# EAGLE design FY - OPTO_BOARD_3_GEN (EAGLE 6.1)

## Sheet 1 of 2
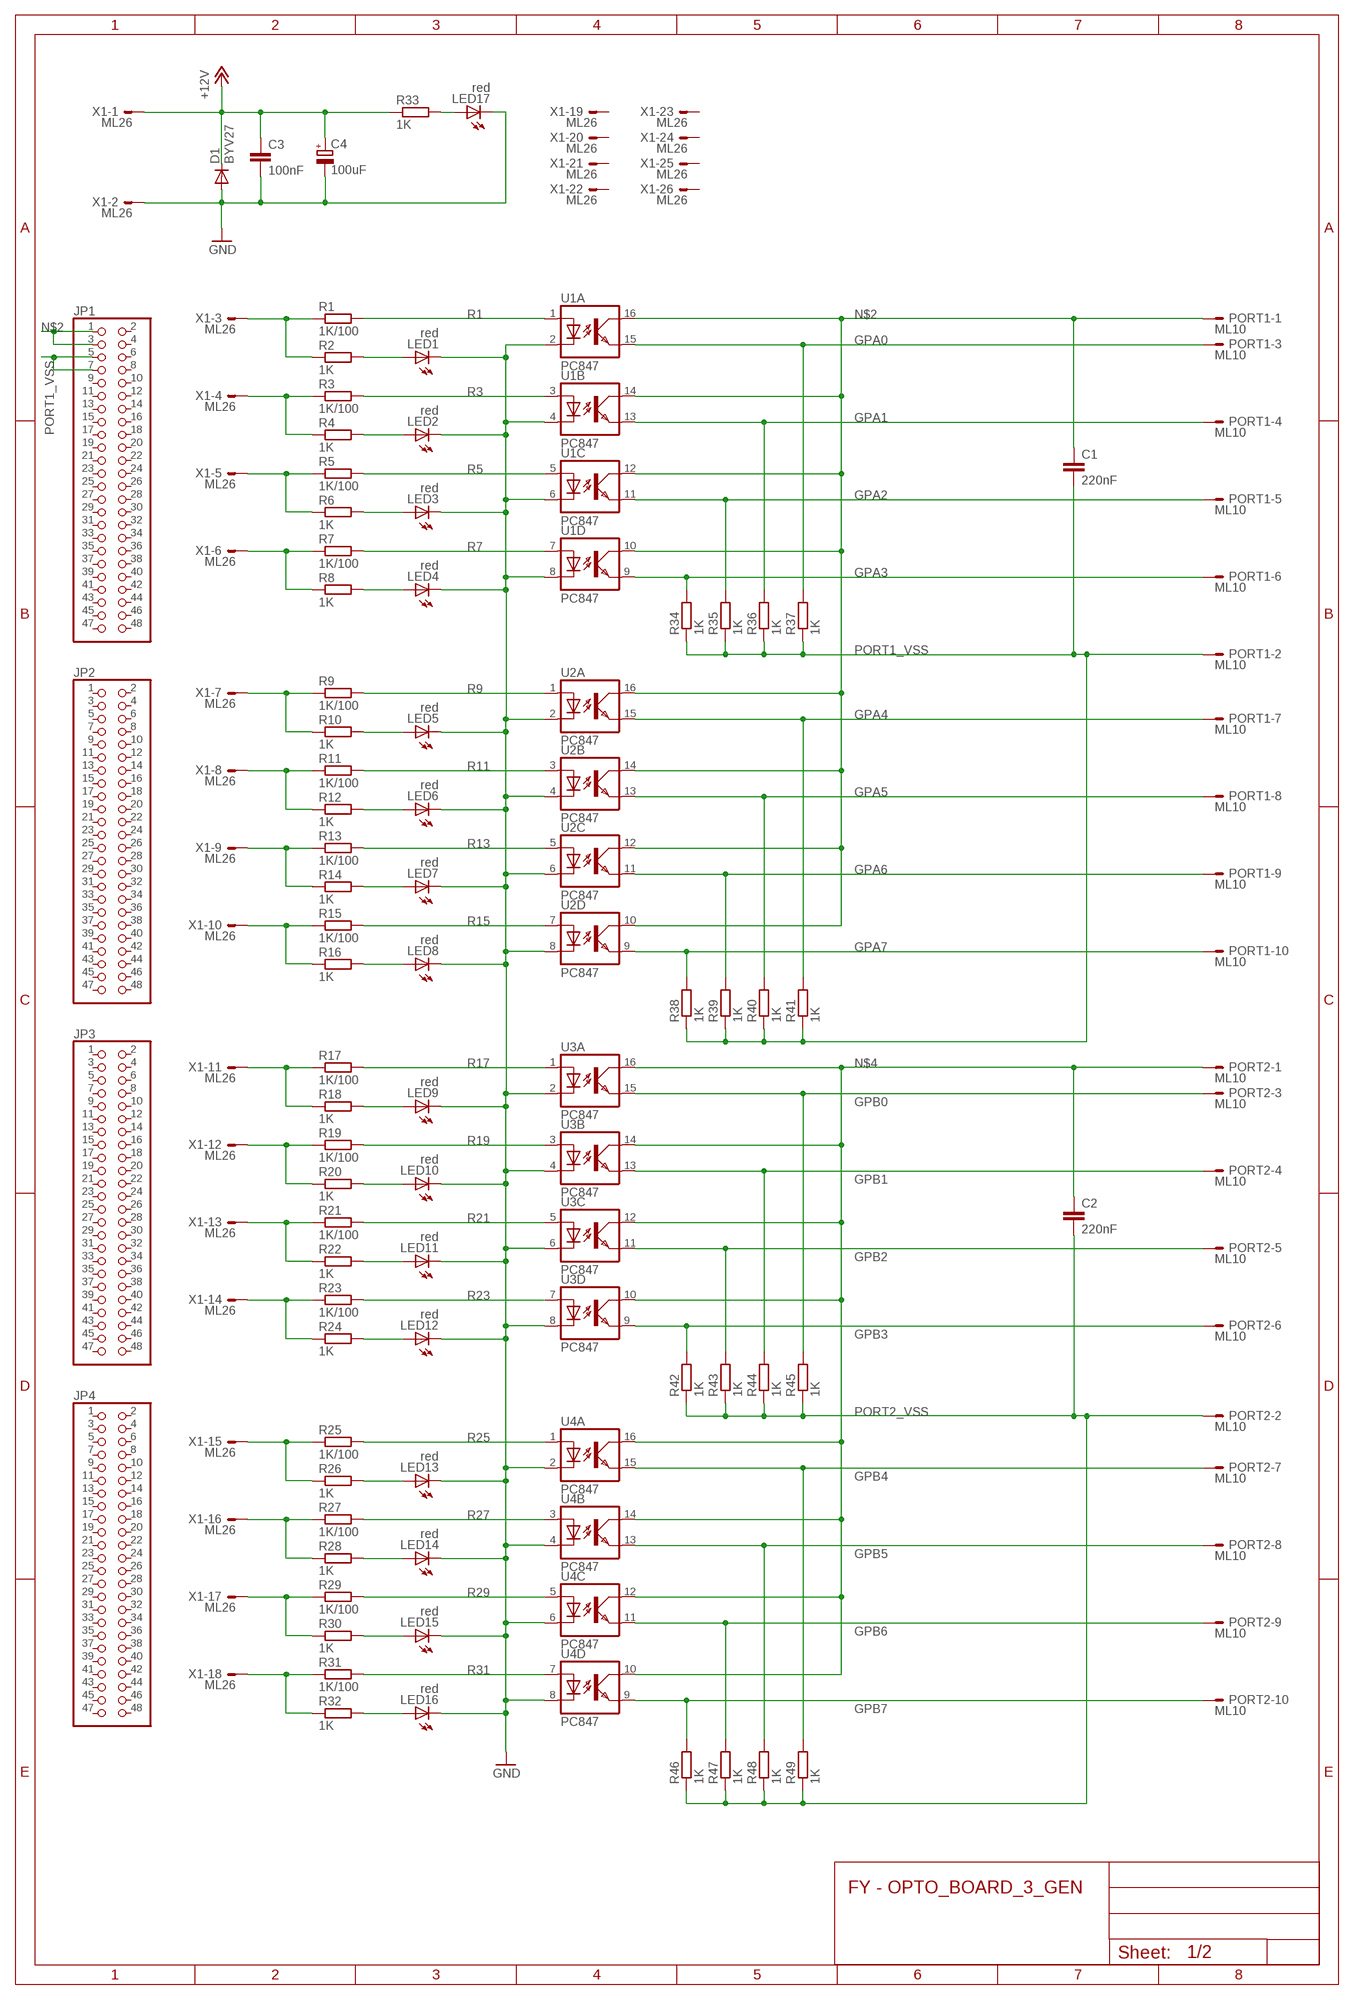
[diagram p0: schematic, sheet 1]

### Parts
C1  220nF  C-EU050-025X075  [C050-025X075]
C2  220nF  C-EU050-025X075  [C050-025X075]
C3  100nF  C-EU050-025X075  [C050-025X075]
C4  100uF  CPOL-EUE5-8.5  [E5-8,5]
D1  BYV27  [SOD57-10]
JP1  PINHD-2X24  [2X24]
JP2  PINHD-2X24  [2X24]
JP3  PINHD-2X24  [2X24]
JP4  PINHD-2X24  [2X24]
LED1  red  LED3MM  [LED3MM]
LED2  red  LED3MM  [LED3MM]
LED3  red  LED3MM  [LED3MM]
LED4  red  LED3MM  [LED3MM]
LED5  red  LED3MM  [LED3MM]
LED6  red  LED3MM  [LED3MM]
LED7  red  LED3MM  [LED3MM]
LED8  red  LED3MM  [LED3MM]
LED9  red  LED3MM  [LED3MM]
LED10  red  LED3MM  [LED3MM]
LED11  red  LED3MM  [LED3MM]
LED12  red  LED3MM  [LED3MM]
LED13  red  LED3MM  [LED3MM]
LED14  red  LED3MM  [LED3MM]
LED15  red  LED3MM  [LED3MM]
LED16  red  LED3MM  [LED3MM]
LED17  red  LED3MM  [LED3MM]
PORT1  ML10  ML10E  [ML10]
PORT2  ML10  ML10E  [ML10]
R1  1K/100  R-EU_0207/10  [0207/10]
R2  1K  R-EU_0207/10  [0207/10]
R3  1K/100  R-EU_0207/10  [0207/10]
R4  1K  R-EU_0207/10  [0207/10]
R5  1K/100  R-EU_0207/10  [0207/10]
R6  1K  R-EU_0207/10  [0207/10]
R7  1K/100  R-EU_0207/10  [0207/10]
R8  1K  R-EU_0207/10  [0207/10]
R9  1K/100  R-EU_0207/10  [0207/10]
R10  1K  R-EU_0207/10  [0207/10]
R11  1K/100  R-EU_0207/10  [0207/10]
R12  1K  R-EU_0207/10  [0207/10]
R13  1K/100  R-EU_0207/10  [0207/10]
R14  1K  R-EU_0207/10  [0207/10]
R15  1K/100  R-EU_0207/10  [0207/10]
R16  1K  R-EU_0207/10  [0207/10]
R17  1K/100  R-EU_0207/10  [0207/10]
R18  1K  R-EU_0207/10  [0207/10]
R19  1K/100  R-EU_0207/10  [0207/10]
R20  1K  R-EU_0207/10  [0207/10]
R21  1K/100  R-EU_0207/10  [0207/10]
R22  1K  R-EU_0207/10  [0207/10]
R23  1K/100  R-EU_0207/10  [0207/10]
R24  1K  R-EU_0207/10  [0207/10]
R25  1K/100  R-EU_0207/10  [0207/10]
R26  1K  R-EU_0207/10  [0207/10]
R27  1K/100  R-EU_0207/10  [0207/10]
R28  1K  R-EU_0207/10  [0207/10]
R29  1K/100  R-EU_0207/10  [0207/10]
R30  1K  R-EU_0207/10  [0207/10]
R31  1K/100  R-EU_0207/10  [0207/10]
R32  1K  R-EU_0207/10  [0207/10]
R33  1K  R-EU_0207/10  [0207/10]
R34  1K  R-EU_0207/10  [0207/10]
R35  1K  R-EU_0207/10  [0207/10]
R36  1K  R-EU_0207/10  [0207/10]
R37  1K  R-EU_0207/10  [0207/10]
R38  1K  R-EU_0207/10  [0207/10]
R39  1K  R-EU_0207/10  [0207/10]
R40  1K  R-EU_0207/10  [0207/10]
R41  1K  R-EU_0207/10  [0207/10]
R42  1K  R-EU_0207/10  [0207/10]
R43  1K  R-EU_0207/10  [0207/10]
R44  1K  R-EU_0207/10  [0207/10]
R45  1K  R-EU_0207/10  [0207/10]
R46  1K  R-EU_0207/10  [0207/10]
R47  1K  R-EU_0207/10  [0207/10]
R48  1K  R-EU_0207/10  [0207/10]
R49  1K  R-EU_0207/10  [0207/10]
U1  PC847  [DIL16]
U2  PC847  [DIL16]
U3  PC847  [DIL16]
U4  PC847  [DIL16]
X1  ML26  ML26E  [ML26]

### Nets
+12V [Power]: C3.1 C4.+ D1.C R33.1 X1.1 ; also sheet 2
GND [Power]: C3.2 C4.- D1.A LED1.K(C) LED2.K(C) LED3.K(C) LED4.K(C) LED5.K(C) LED6.K(C) LED7.K(C) LED8.K(C) LED9.K(C) LED10.K(C) LED11.K(C) LED12.K(C) LED13.K(C) LED14.K(C) LED15.K(C) LED16.K(C) LED17.K(C) U1.2(A:C) U1.4(B:C) U1.6(C:C) U1.8(D:C) U2.2(A:C) U2.4(B:C) U2.6(C:C) U2.8(D:C) U3.2(A:C) U3.4(B:C) U3.6(C:C) U3.8(D:C) U4.2(A:C) U4.4(B:C) U4.6(C:C) U4.8(D:C) X1.2
GPA0: PORT1.3 R37.2 U1.15(A:EMIT) ; also sheet 2
GPA1: PORT1.4 R36.2 U1.13(B:EMIT) ; also sheet 2
GPA2: PORT1.5 R35.2 U1.11(C:EMIT) ; also sheet 2
GPA3: PORT1.6 R34.2 U1.9(D:EMIT) ; also sheet 2
GPA4: PORT1.7 R41.2 U2.15(A:EMIT) ; also sheet 2
GPA5: PORT1.8 R40.2 U2.13(B:EMIT) ; also sheet 2
GPA6: PORT1.9 R39.2 U2.11(C:EMIT) ; also sheet 2
GPA7: PORT1.10 R38.2 U2.9(D:EMIT) ; also sheet 2
GPB0: PORT2.3 R45.2 U3.15(A:EMIT) ; also sheet 2
GPB1: PORT2.4 R44.2 U3.13(B:EMIT) ; also sheet 2
GPB2: PORT2.5 R43.2 U3.11(C:EMIT) ; also sheet 2
GPB3: PORT2.6 R42.2 U3.9(D:EMIT) ; also sheet 2
GPB4: PORT2.7 R49.2 U4.15(A:EMIT) ; also sheet 2
GPB5: PORT2.8 R48.2 U4.13(B:EMIT) ; also sheet 2
GPB6: PORT2.9 R47.2 U4.11(C:EMIT) ; also sheet 2
GPB7: PORT2.10 R46.2 U4.9(D:EMIT) ; also sheet 2
N$2 [Power]: C1.1 JP1.1 JP1.3 PORT1.1 U1.10(D:COL) U1.12(C:COL) U1.14(B:COL) U1.16(A:COL) U2.10(D:COL) U2.12(C:COL) U2.14(B:COL) U2.16(A:COL)
N$3: LED1.A R2.2
N$4 [Power]: C2.1 PORT2.1 U3.10(D:COL) U3.12(C:COL) U3.14(B:COL) U3.16(A:COL) U4.10(D:COL) U4.12(C:COL) U4.14(B:COL) U4.16(A:COL) ; also sheet 2
N$5: LED2.A R4.2
N$6: LED3.A R6.2
N$7: LED4.A R8.2
N$16: LED5.A R10.2
N$20: LED6.A R12.2
N$23: LED7.A R14.2
N$26: LED8.A R16.2
N$30: LED9.A R18.2
N$33: LED10.A R20.2
N$36: LED11.A R22.2
N$39: LED12.A R24.2
N$41: LED13.A R26.2
N$44: LED14.A R28.2
N$47: LED15.A R30.2
N$50: LED16.A R32.2
N$52: LED17.A R33.2
PORT1_VSS [Power]: C1.2 JP1.5 JP1.7 PORT1.2 R34.1 R35.1 R36.1 R37.1 R38.1 R39.1 R40.1 R41.1 ; also sheet 2
PORT2_VSS [Power]: C2.2 PORT2.2 R42.1 R43.1 R44.1 R45.1 R46.1 R47.1 R48.1 R49.1 ; also sheet 2
R1: R1.2 U1.1(A:A) ; also sheet 2
R3: R3.2 U1.3(B:A) ; also sheet 2
R5: R5.2 U1.5(C:A) ; also sheet 2
R7: R7.2 U1.7(D:A) ; also sheet 2
R9: R9.2 U2.1(A:A) ; also sheet 2
R11: R11.2 U2.3(B:A) ; also sheet 2
R13: R13.2 U2.5(C:A) ; also sheet 2
R15: R15.2 U2.7(D:A) ; also sheet 2
R17: R17.2 U3.1(A:A) ; also sheet 2
R19: R19.2 U3.3(B:A) ; also sheet 2
R21: R21.2 U3.5(C:A) ; also sheet 2
R23: R23.2 U3.7(D:A) ; also sheet 2
R25: R25.2 U4.1(A:A) ; also sheet 2
R27: R27.2 U4.3(B:A) ; also sheet 2
R29: R29.2 U4.5(C:A) ; also sheet 2
R31: R31.2 U4.7(D:A) ; also sheet 2
X1-3: R1.1 R2.1 X1.3
X1-4: R3.1 R4.1 X1.4
X1-5: R5.1 R6.1 X1.5
X1-6: R7.1 R8.1 X1.6
X1-7: R9.1 R10.1 X1.7
X1-8: R11.1 R12.1 X1.8
X1-9: R13.1 R14.1 X1.9
X1-10: R15.1 R16.1 X1.10
X1-11: R17.1 R18.1 X1.11
X1-12: R19.1 R20.1 X1.12
X1-13: R21.1 R22.1 X1.13
X1-14: R23.1 R24.1 X1.14
X1-15: R25.1 R26.1 X1.15
X1-16: R27.1 R28.1 X1.16
X1-17: R29.1 R30.1 X1.17
X1-18: R31.1 R32.1 X1.18
Unconnected: JP1.2 JP1.4 JP1.6 JP1.8 JP1.9 JP1.10 JP1.11 JP1.12 JP1.13 JP1.14 JP1.15 JP1.16 JP1.17 JP1.18 JP1.19 JP1.20 JP1.21 JP1.22 JP1.23 JP1.24 JP1.25 JP1.26 JP1.27 JP1.28 JP1.29 JP1.30 JP1.31 JP1.32 JP1.33 JP1.34 JP1.35 JP1.36 JP1.37 JP1.38 JP1.39 JP1.40 JP1.41 JP1.42 JP1.43 JP1.44 JP1.45 JP1.46 JP1.47 JP1.48 JP2.1 JP2.2 JP2.3 JP2.4 JP2.5 JP2.6 JP2.7 JP2.8 JP2.9 JP2.10 JP2.11 JP2.12 JP2.13 JP2.14 JP2.15 JP2.16 JP2.17 JP2.18 JP2.19 JP2.20 JP2.21 JP2.22 JP2.23 JP2.24 JP2.25 JP2.26 JP2.27 JP2.28 JP2.29 JP2.30 JP2.31 JP2.32 JP2.33 JP2.34 JP2.35 JP2.36 JP2.37 JP2.38 JP2.39 JP2.40 JP2.41 JP2.42 JP2.43 JP2.44 JP2.45 JP2.46 JP2.47 JP2.48 JP3.1 JP3.2 JP3.3 JP3.4 JP3.5 JP3.6 JP3.7 JP3.8 JP3.9 JP3.10 JP3.11 JP3.12 JP3.13 JP3.14 JP3.15 JP3.16 JP3.17 JP3.18 JP3.19 JP3.20 JP3.21 JP3.22 JP3.23 JP3.24 JP3.25 JP3.26 JP3.27 JP3.28 JP3.29 JP3.30 JP3.31 JP3.32 JP3.33 JP3.34 JP3.35 JP3.36 JP3.37 JP3.38 JP3.39 JP3.40 JP3.41 JP3.42 JP3.43 JP3.44 JP3.45 JP3.46 JP3.47 JP3.48 JP4.1 JP4.2 JP4.3 JP4.4 JP4.5 JP4.6 JP4.7 JP4.8 JP4.9 JP4.10 JP4.11 JP4.12 JP4.13 JP4.14 JP4.15 JP4.16 JP4.17 JP4.18 JP4.19 JP4.20 JP4.21 JP4.22 JP4.23 JP4.24 JP4.25 JP4.26 JP4.27 JP4.28 JP4.29 JP4.30 JP4.31 JP4.32 JP4.33 JP4.34 JP4.35 JP4.36 JP4.37 JP4.38 JP4.39 JP4.40 JP4.41 JP4.42 JP4.43 JP4.44 JP4.45 JP4.46 JP4.47 JP4.48 X1.19 X1.20 X1.21 X1.22 X1.23 X1.24 X1.25 X1.26

## Sheet 2 of 2
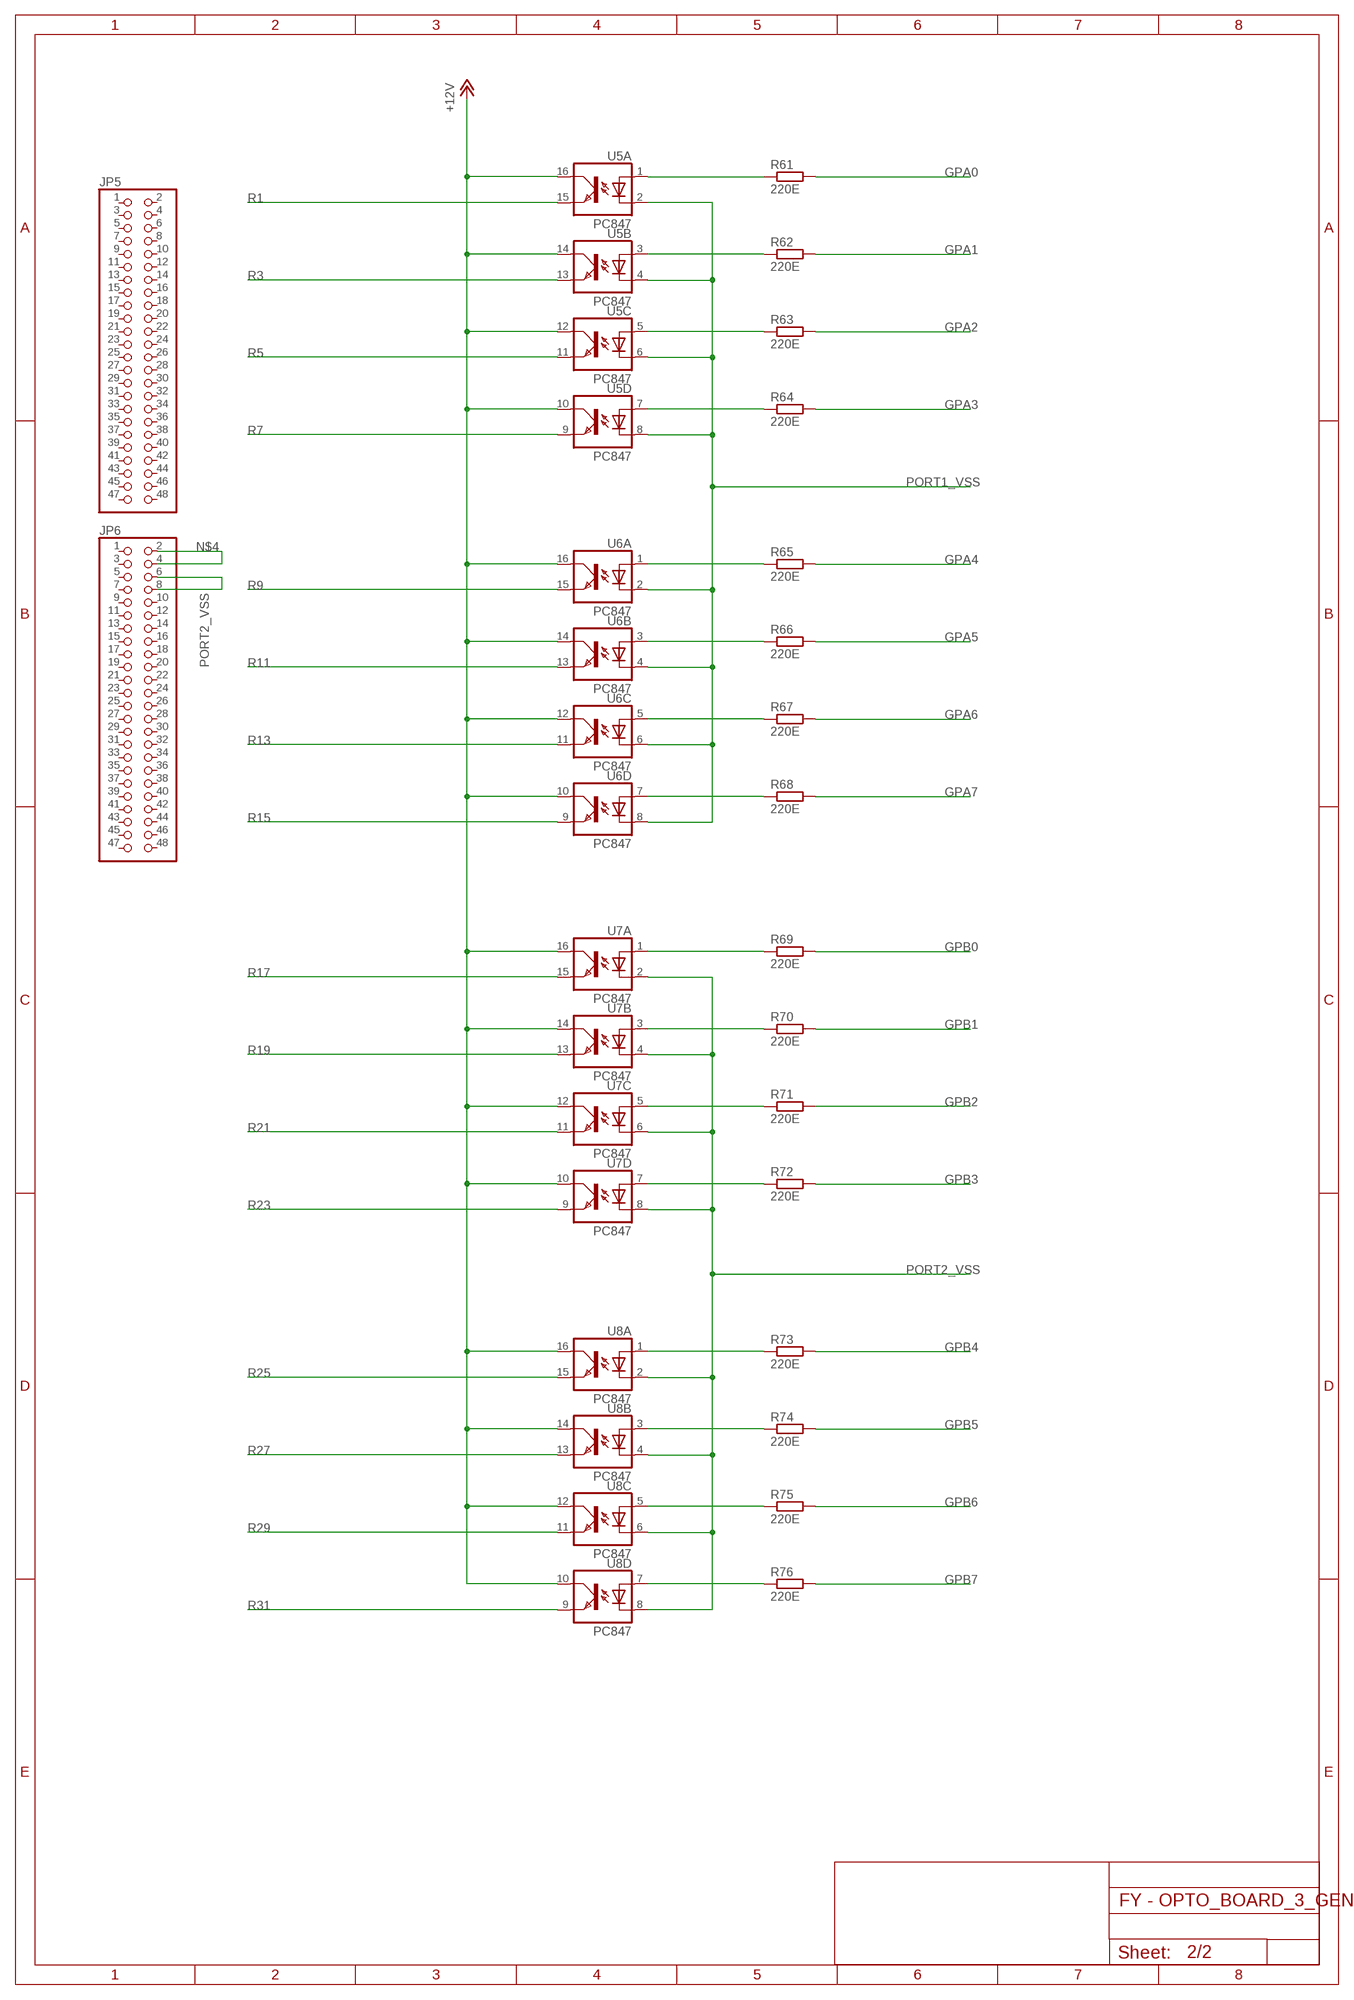
[diagram p1: schematic, sheet 2]

### Parts
JP5  PINHD-2X24  [2X24]
JP6  PINHD-2X24  [2X24]
R61  220E  R-EU_0207/10  [0207/10]
R62  220E  R-EU_0207/10  [0207/10]
R63  220E  R-EU_0207/10  [0207/10]
R64  220E  R-EU_0207/10  [0207/10]
R65  220E  R-EU_0207/10  [0207/10]
R66  220E  R-EU_0207/10  [0207/10]
R67  220E  R-EU_0207/10  [0207/10]
R68  220E  R-EU_0207/10  [0207/10]
R69  220E  R-EU_0207/10  [0207/10]
R70  220E  R-EU_0207/10  [0207/10]
R71  220E  R-EU_0207/10  [0207/10]
R72  220E  R-EU_0207/10  [0207/10]
R73  220E  R-EU_0207/10  [0207/10]
R74  220E  R-EU_0207/10  [0207/10]
R75  220E  R-EU_0207/10  [0207/10]
R76  220E  R-EU_0207/10  [0207/10]
U5  PC847  [DIL16]
U6  PC847  [DIL16]
U7  PC847  [DIL16]
U8  PC847  [DIL16]

### Nets
+12V [Power]: U5.10(D:COL) U5.12(C:COL) U5.14(B:COL) U5.16(A:COL) U6.10(D:COL) U6.12(C:COL) U6.14(B:COL) U6.16(A:COL) U7.10(D:COL) U7.12(C:COL) U7.14(B:COL) U7.16(A:COL) U8.10(D:COL) U8.12(C:COL) U8.14(B:COL) U8.16(A:COL) ; also sheet 1
GPA0: R61.2 ; also sheet 1
GPA1: R62.2 ; also sheet 1
GPA2: R63.2 ; also sheet 1
GPA3: R64.2 ; also sheet 1
GPA4: R65.2 ; also sheet 1
GPA5: R66.2 ; also sheet 1
GPA6: R67.2 ; also sheet 1
GPA7: R68.2 ; also sheet 1
GPB0: R69.2 ; also sheet 1
GPB1: R70.2 ; also sheet 1
GPB2: R71.2 ; also sheet 1
GPB3: R72.2 ; also sheet 1
GPB4: R73.2 ; also sheet 1
GPB5: R74.2 ; also sheet 1
GPB6: R75.2 ; also sheet 1
GPB7: R76.2 ; also sheet 1
N$1: R61.1 U5.1(A:A)
N$4 [Power]: JP6.2 JP6.4 ; also sheet 1
N$11: R62.1 U5.3(B:A)
N$12: R63.1 U5.5(C:A)
N$13: R64.1 U5.7(D:A)
N$14: R65.1 U6.1(A:A)
N$15: R66.1 U6.3(B:A)
N$17: R67.1 U6.5(C:A)
N$18: R68.1 U6.7(D:A)
N$19: R69.1 U7.1(A:A)
N$22: R70.1 U7.3(B:A)
N$25: R71.1 U7.5(C:A)
N$29: R72.1 U7.7(D:A)
N$31: R73.1 U8.1(A:A)
N$32: R74.1 U8.3(B:A)
N$35: R75.1 U8.5(C:A)
N$38: R76.1 U8.7(D:A)
PORT1_VSS [Power]: U5.2(A:C) U5.4(B:C) U5.6(C:C) U5.8(D:C) U6.2(A:C) U6.4(B:C) U6.6(C:C) U6.8(D:C) ; also sheet 1
PORT2_VSS [Power]: JP6.6 JP6.8 U7.2(A:C) U7.4(B:C) U7.6(C:C) U7.8(D:C) U8.2(A:C) U8.4(B:C) U8.6(C:C) U8.8(D:C) ; also sheet 1
R1: U5.15(A:EMIT) ; also sheet 1
R3: U5.13(B:EMIT) ; also sheet 1
R5: U5.11(C:EMIT) ; also sheet 1
R7: U5.9(D:EMIT) ; also sheet 1
R9: U6.15(A:EMIT) ; also sheet 1
R11: U6.13(B:EMIT) ; also sheet 1
R13: U6.11(C:EMIT) ; also sheet 1
R15: U6.9(D:EMIT) ; also sheet 1
R17: U7.15(A:EMIT) ; also sheet 1
R19: U7.13(B:EMIT) ; also sheet 1
R21: U7.11(C:EMIT) ; also sheet 1
R23: U7.9(D:EMIT) ; also sheet 1
R25: U8.15(A:EMIT) ; also sheet 1
R27: U8.13(B:EMIT) ; also sheet 1
R29: U8.11(C:EMIT) ; also sheet 1
R31: U8.9(D:EMIT) ; also sheet 1
Unconnected: JP5.1 JP5.2 JP5.3 JP5.4 JP5.5 JP5.6 JP5.7 JP5.8 JP5.9 JP5.10 JP5.11 JP5.12 JP5.13 JP5.14 JP5.15 JP5.16 JP5.17 JP5.18 JP5.19 JP5.20 JP5.21 JP5.22 JP5.23 JP5.24 JP5.25 JP5.26 JP5.27 JP5.28 JP5.29 JP5.30 JP5.31 JP5.32 JP5.33 JP5.34 JP5.35 JP5.36 JP5.37 JP5.38 JP5.39 JP5.40 JP5.41 JP5.42 JP5.43 JP5.44 JP5.45 JP5.46 JP5.47 JP5.48 JP6.1 JP6.3 JP6.5 JP6.7 JP6.9 JP6.10 JP6.11 JP6.12 JP6.13 JP6.14 JP6.15 JP6.16 JP6.17 JP6.18 JP6.19 JP6.20 JP6.21 JP6.22 JP6.23 JP6.24 JP6.25 JP6.26 JP6.27 JP6.28 JP6.29 JP6.30 JP6.31 JP6.32 JP6.33 JP6.34 JP6.35 JP6.36 JP6.37 JP6.38 JP6.39 JP6.40 JP6.41 JP6.42 JP6.43 JP6.44 JP6.45 JP6.46 JP6.47 JP6.48

## Library data of the parts
C1-C3 = rcl:C-EU: CAPACITOR, European symbol
C4 = rcl:CPOL-EU: POLARIZED CAPACITOR, European symbol
D1 = diode:BYV27: DIODE ultra fast
JP1-JP6 = pinhead:PINHD-2X24: PIN HEADER
LED1-LED17 = led:LED: LED OSRAM: - CHIPLED LG R971, LG N971, LY N971, LG Q971, LY Q971, LO R971, LY R971 LH N974, LH R974 LS Q976, LO Q976, LY Q976 LO Q996 - Hyper CHIPLED LW Q18S LB Q993, LB Q99A, LB R99A - SideLED LS A670, LO A670, LY A670, LG A670, LP A670 LB A673, LV A673, LT A673, LW A673 LH A674 LY A675 LS A676, LA A676, LO A676, LY A676, LW A676 LS A679, LY A679, LG A679 - Hyper Micro SIDELED® LS Y876, LA Y876, LO Y876, LY Y876 LT Y87S - SmartLED LW L88C, LW L88S LB L89C, LB L89S, LG L890 LS L89K, LO L89K, LY L89K LS L896, LA L896, LO L896, LY L896 - TOPLED LS T670, LO T670, LY T670, LG T670, LP T670 LSG T670, LSP T670, LSY T670, LOP T670, LYG T670 LG T671, LOG T671, LSG T671 LB T673, LV T673, LT T673, LW T673 LH T674 LS T676, LA T676, LO T676, LY T676, LB T676, LH T676, LSB T676, LW T676 LB T67C, LV T67C, LT T67C, LS T67K, LO T67K, LY T67K, LW E67C LS E67B, LA E67B, LO E67B, LY E67B, LB E67C, LV E67C, LT E67C LW T67C LS T679, LY T679, LG T679 LS T770, LO T770, LY T770, LG T770, LP T770 LB T773, LV T773, LT T773, LW T773 LH T774 LS E675, LA E675, LY E675, LS T675 LS T776, LA T776, LO T776, LY T776, LB T776 LHGB T686 LT T68C, LB T68C - Hyper Mini TOPLED® LB M676 - Mini TOPLED Santana® LG M470 LS M47K, LO M47K, LY M47K Source: http://www.osram.convergy.de LUXEON: - LUMILED® LXK2-PW12-R00, LXK2-PW12-S00, LXK2-PW14-U00, LXK2-PW14-V00 LXK2-PM12-R00, LXK2-PM12-S00, LXK2-PM14-U00 LXK2-PE12-Q00, LXK2-PE12-R00, LXK2-PE12-S00, LXK2-PE14-T00, LXK2-PE14-U00 LXK2-PB12-K00, LXK2-PB12-L00, LXK2-PB12-M00, LXK2-PB14-N00, LXK2-PB14-P00, LXK2-PB14-Q00 LXK2-PR12-L00, LXK2-PR12-M00, LXK2-PR14-Q00, LXK2-PR14-R00 LXK2-PD12-Q00, LXK2-PD12-R00, LXK2-PD12-S00 LXK2-PH12-R00, LXK2-PH12-S00 LXK2-PL12-P00, LXK2-PL12-Q00, LXK2-PL12-R00 Source: www.luxeon.com KINGBRIGHT: KA-3528ASYC Source: www.kingbright.com
PORT1 PORT2 = con-harting-ml:ML10?E: HARTING; OC_FARNELL: unknown; OC_NEWARK: unknown
R1-R49 R61-R76 = rcl:R-EU_: RESISTOR, European symbol
U1-U8 = optocoupler:PC847: SHARP OPTO COUPLER; OC_FARNELL: 9707735; OC_NEWARK: unknown
X1 = con-harting-ml:ML26?E: HARTING; OC_FARNELL: unknown; OC_NEWARK: unknown

## Net classes
0 default: width 0.305 mm, clearance 0.305 mm
1 Power: width 0.61 mm, clearance 0.305 mm

## Board
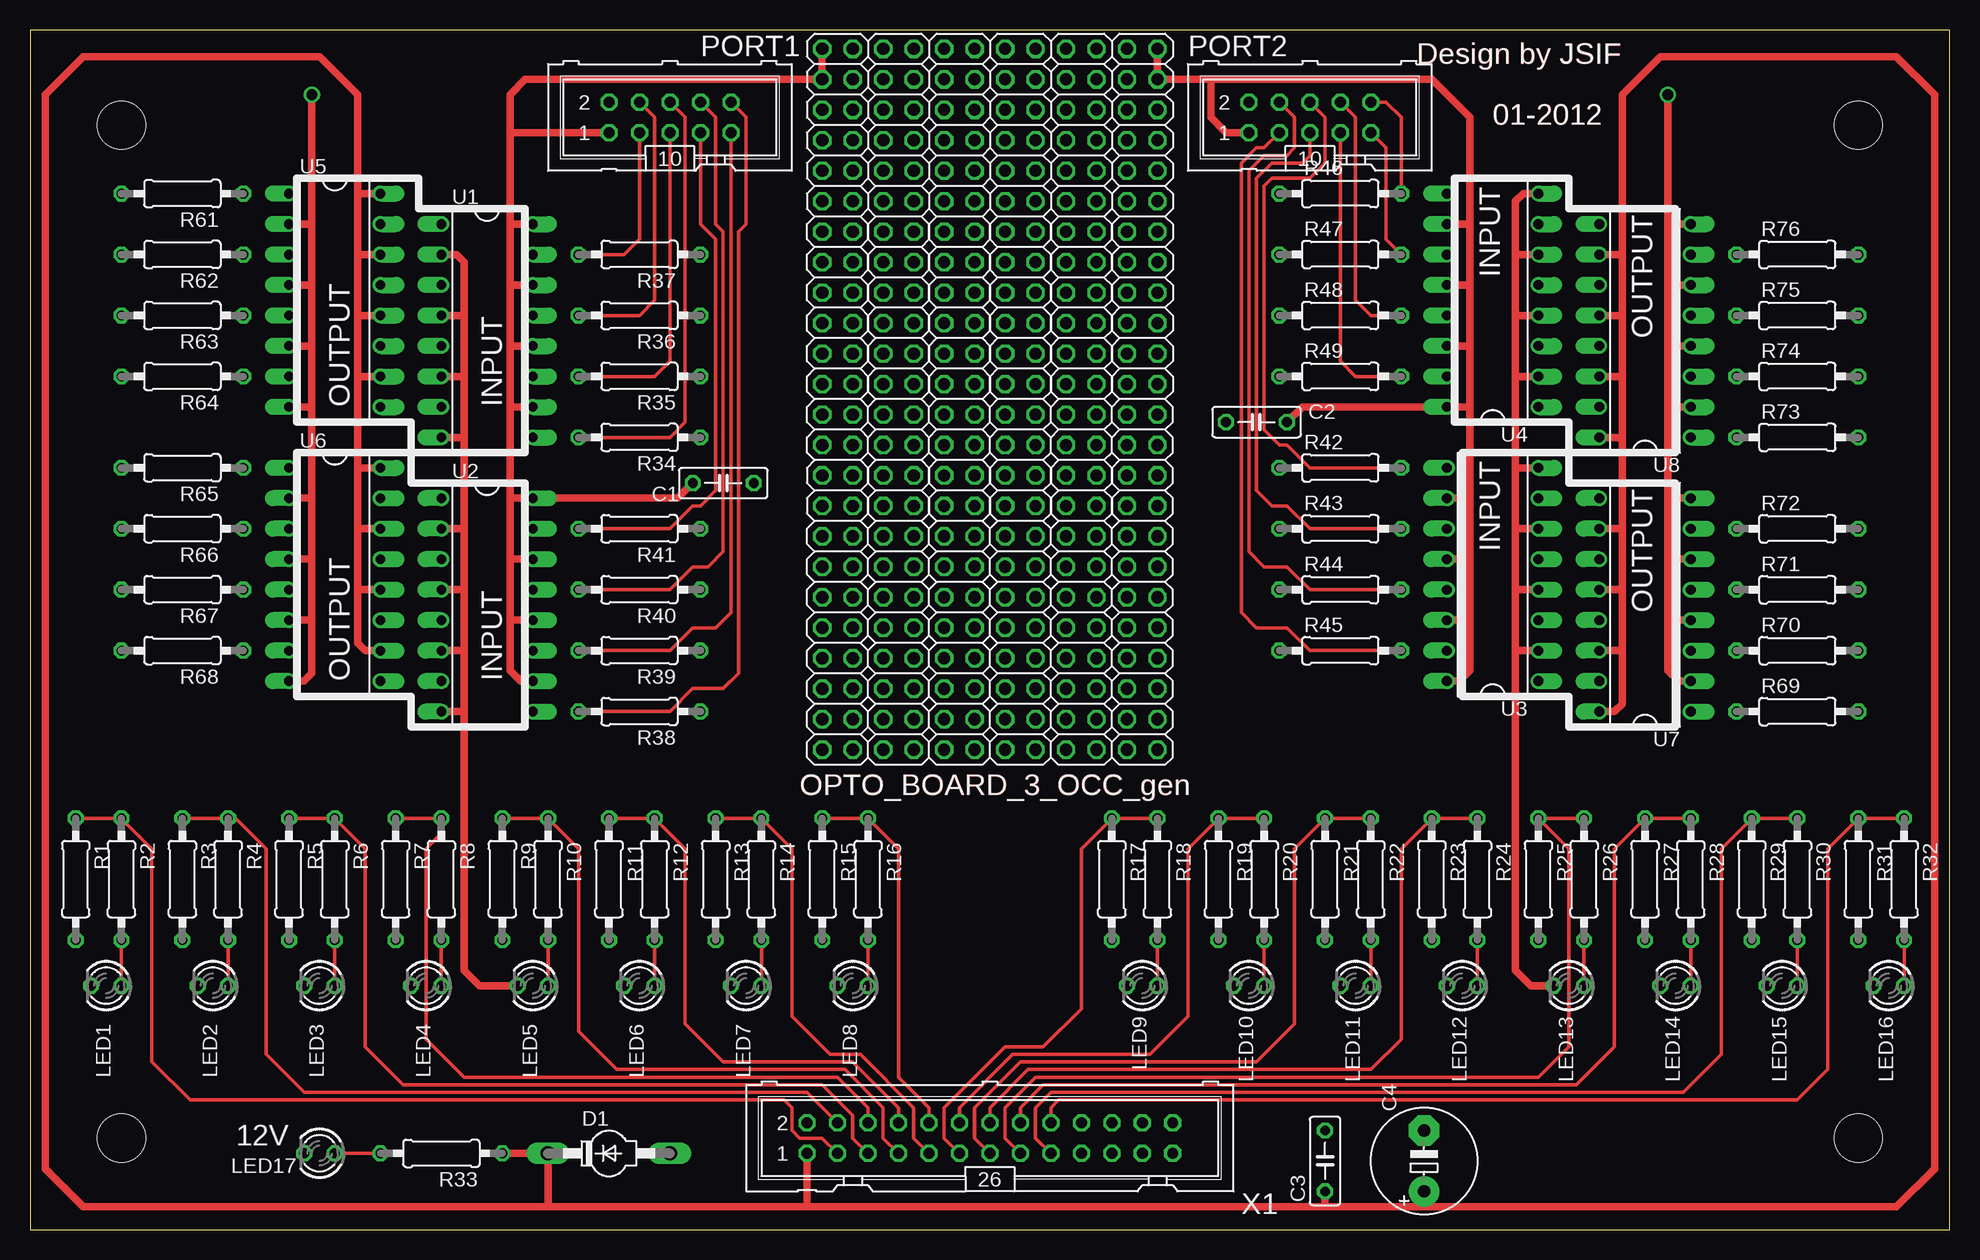
[diagram p2: board, top side]
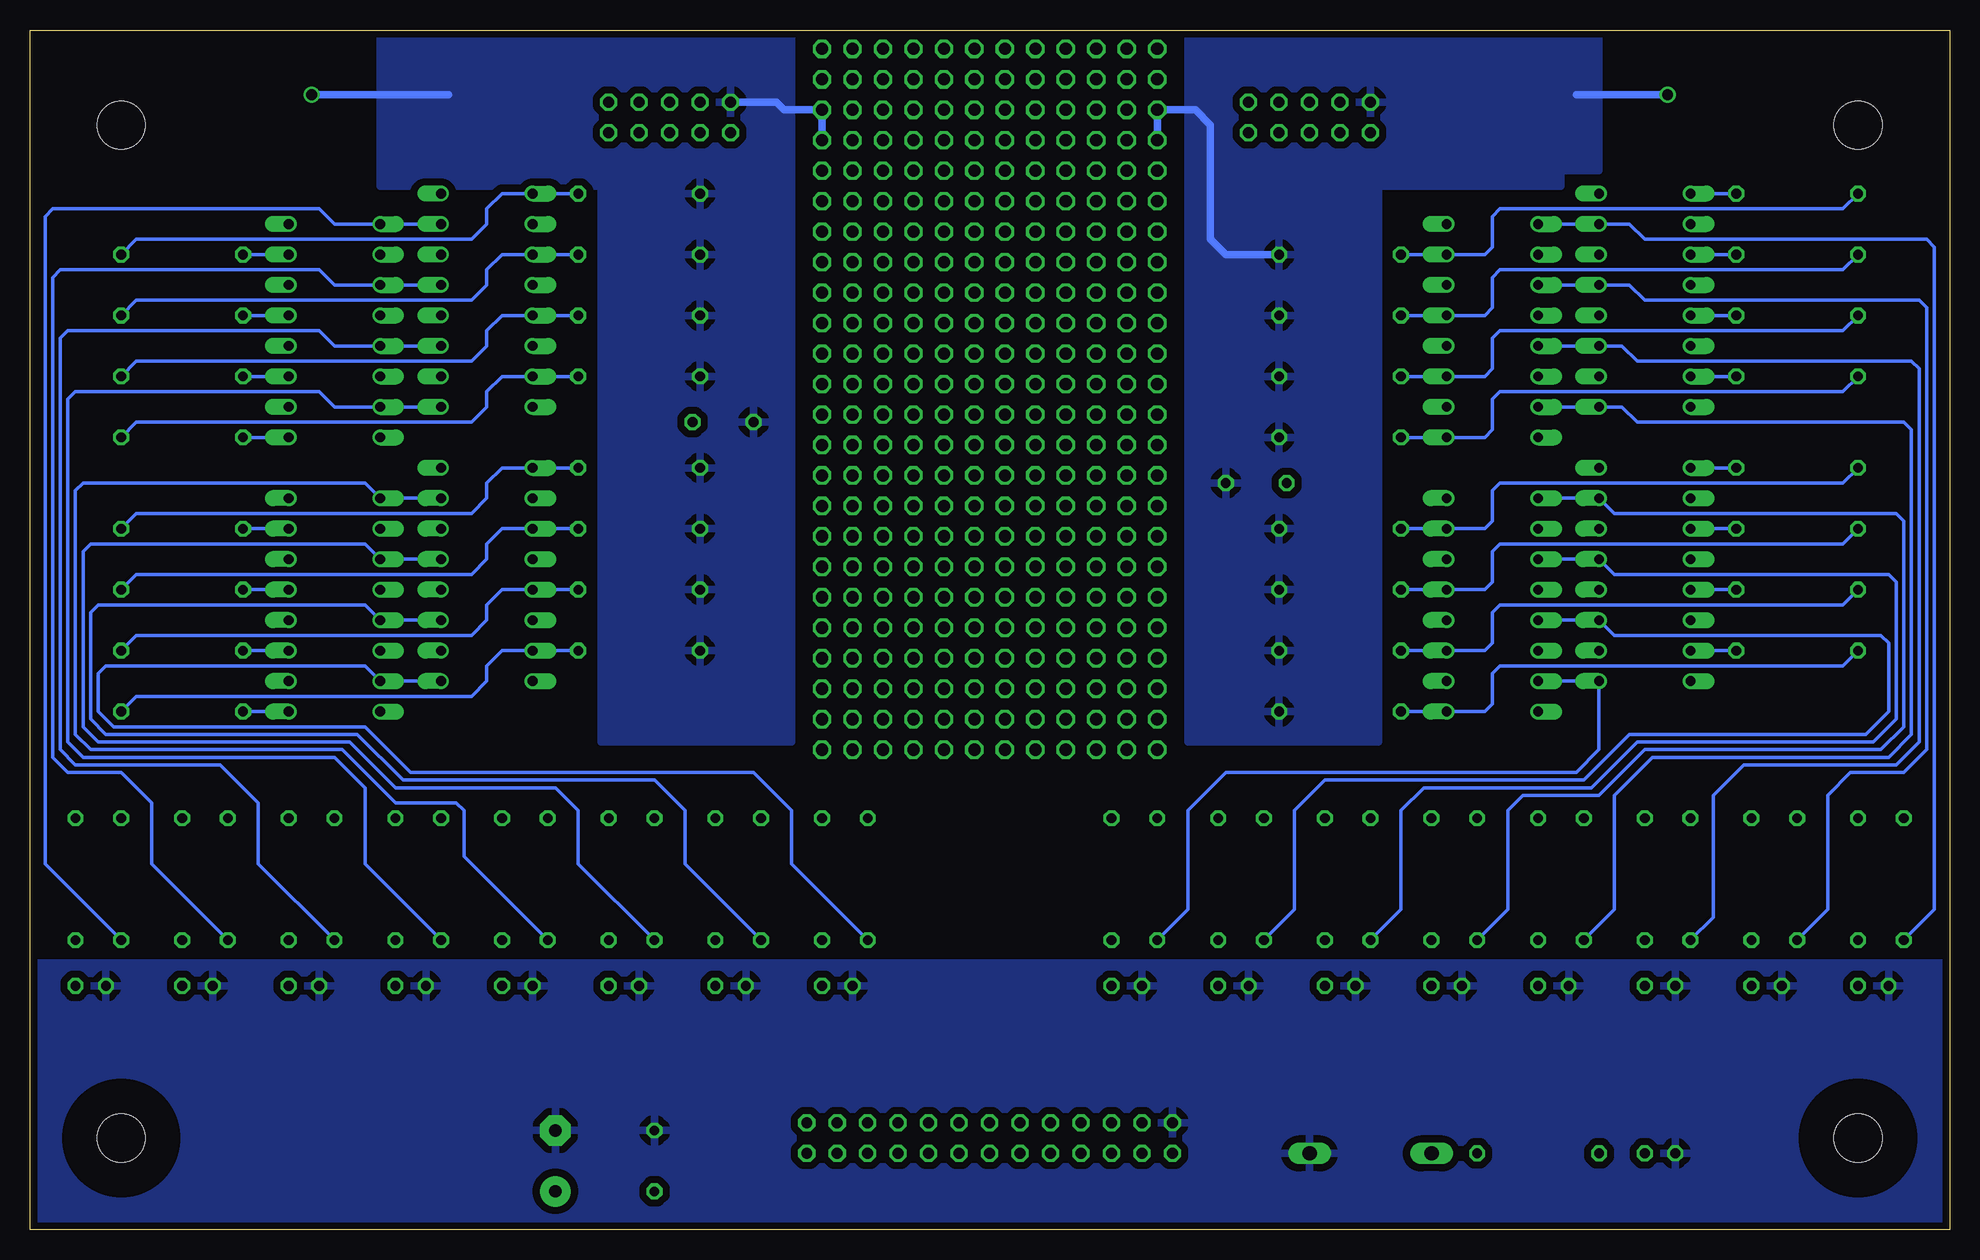
[diagram p3: board, bottom side, seen from below]

Size 160 x 100 mm. Coordinates in mm from the lower left corner, seen from the top.
Outline: 0,0 160,0 160,100 0,100 0,0
Copper layers (1*16): Top 0.035mm / dielectric 1.5mm / Bottom 0.035mm
Design rules: minimum track width 12mil, minimum drill 12mil, track to track 8mil, track to pad 8mil, pad to pad 8mil, via to via 8mil, smd to smd 8mil, copper to edge 24mil, drill to drill 8mil, minimum pad ring 10mil, minimum via ring 8mil, stop-mask expansion 4mil, vias tented up to drill 0mil, thermal gap 24mil
Holes 4 mm at 7.62,7.62 7.62,92.08 152.4,92.08 152.4,7.62
bRestrict: area 3.6,3.6 to 11.6,11.6; area 148.4,3.6 to 156.4,11.6; area 148.4,88.1 to 156.4,96.1; area 3.6,88.1 to 11.6,96.1

### Footprints (pad centres in the part's own frame; a part is rotated, then mirrored left to right if it is on the bottom)
C050-025X075 = drill 0.813 octagon: 1 -2.54,0; 2 2.54,0
E5-8,5 = drill 1.016 pad 2.54: + -2.54,0 | drill 1.016 pad 2.54 octagon: - 2.54,0
SOD57-10 = drill 1.194 long: A 5.08,0; C -5.08,0
2X24 = drill 1.016 octagon: 1 -27.94,-1.27; 2 -27.94,1.27; 3 -25.4,-1.27; 4 -25.4,1.27; 5 -22.86,-1.27; 6 -22.86,1.27; 7 -20.32,-1.27; 8 -20.32,1.27; 9 -17.78,-1.27; 10 -17.78,1.27; 11 -15.24,-1.27; 12 -15.24,1.27; 13 -12.7,-1.27; 14 -12.7,1.27; 15 -10.16,-1.27; 16 -10.16,1.27; 17 -7.62,-1.27; 18 -7.62,1.27; 19 -5.08,-1.27; 20 -5.08,1.27; 21 -2.54,-1.27; 22 -2.54,1.27; 23 0,-1.27; 24 0,1.27; 25 2.54,-1.27; 26 2.54,1.27; 27 5.08,-1.27; 28 5.08,1.27; 29 7.62,-1.27; 30 7.62,1.27; 31 10.16,-1.27; 32 10.16,1.27; 33 12.7,-1.27; 34 12.7,1.27; 35 15.24,-1.27; 36 15.24,1.27; 37 17.78,-1.27; 38 17.78,1.27; 39 20.32,-1.27; 40 20.32,1.27; 41 22.86,-1.27; 42 22.86,1.27; 43 25.4,-1.27; 44 25.4,1.27; 45 27.94,-1.27; 46 27.94,1.27; 47 30.48,-1.27; 48 30.48,1.27
LED3MM = drill 0.813 octagon: A -1.27,0; K 1.27,0
ML10 = drill 0.914 octagon: 1 -5.08,-1.27; 2 -5.08,1.27; 3 -2.54,-1.27; 4 -2.54,1.27; 5 0,-1.27; 6 0,1.27; 7 2.54,-1.27; 8 2.54,1.27; 9 5.08,-1.27; 10 5.08,1.27
0207/10 = drill 0.813 octagon: 1 -5.08,0; 2 5.08,0
DIL16 = drill 0.813 offset: 1 -8.89,-3.81; 2 -6.35,-3.81; 3 -3.81,-3.81; 4 -1.27,-3.81; 5 1.27,-3.81; 6 3.81,-3.81; 7 6.35,-3.81; 8 8.89,-3.81; 9 8.89,3.81; 10 6.35,3.81; 11 3.81,3.81; 12 1.27,3.81; 13 -1.27,3.81; 14 -3.81,3.81; 15 -6.35,3.81; 16 -8.89,3.81
ML26 = drill 0.914 octagon: 1 -15.24,-1.27; 2 -15.24,1.27; 3 -12.7,-1.27; 4 -12.7,1.27; 5 -10.16,-1.27; 6 -10.16,1.27; 7 -7.62,-1.27; 8 -7.62,1.27; 9 -5.08,-1.27; 10 -5.08,1.27; 11 -2.54,-1.27; 12 -2.54,1.27; 13 0,-1.27; 14 0,1.27; 15 2.54,-1.27; 16 2.54,1.27; 17 5.08,-1.27; 18 5.08,1.27; 19 7.62,-1.27; 20 7.62,1.27; 21 10.16,-1.27; 22 10.16,1.27; 23 12.7,-1.27; 24 12.7,1.27; 25 15.24,-1.27; 26 15.24,1.27

### Placement (x,y rotation side)
C1  57.78,62.23 0 top
C2  102.23,67.31 180 top
C3  107.95,5.71 90 top
C4  116.2,5.71 90 top
D1  48.26,6.35 0 top
JP1  67.31,70.48 270 top
JP2  72.39,70.48 270 top
JP3  77.47,70.48 270 top
JP4  82.55,70.48 270 top
JP5  87.63,70.48 270 top
JP6  92.71,70.48 270 top
LED1  6.35,20.32 180 top
LED2  15.24,20.32 180 top
LED3  24.13,20.32 180 top
LED4  33.02,20.32 180 top
LED5  41.91,20.32 180 top
LED6  50.8,20.32 180 top
LED7  59.69,20.32 180 top
LED8  68.58,20.32 180 top
LED9  92.71,20.32 180 top
LED10  101.6,20.32 180 top
LED11  110.49,20.32 180 top
LED12  119.38,20.32 180 top
LED13  128.27,20.32 180 top
LED14  137.16,20.32 180 top
LED15  146.05,20.32 180 top
LED16  154.94,20.32 180 top
LED17  24.13,6.35 180 top
PORT1  53.34,92.71 0 top
PORT2  106.68,92.71 0 top
R1  3.81,29.21 270 top
R2  7.62,29.21 270 top
R3  12.7,29.21 270 top
R4  16.51,29.21 270 top
R5  21.59,29.21 270 top
R6  25.4,29.21 270 top
R7  30.48,29.21 270 top
R8  34.29,29.21 270 top
R9  39.37,29.21 270 top
R10  43.18,29.21 270 top
R11  48.26,29.21 270 top
R12  52.07,29.21 270 top
R13  57.15,29.21 270 top
R14  60.96,29.21 270 top
R15  66.04,29.21 270 top
R16  69.85,29.21 270 top
R17  90.17,29.21 270 top
R18  93.98,29.21 270 top
R19  99.06,29.21 270 top
R20  102.87,29.21 270 top
R21  107.95,29.21 270 top
R22  111.76,29.21 270 top
R23  116.84,29.21 270 top
R24  120.65,29.21 270 top
R25  125.73,29.21 270 top
R26  129.54,29.21 270 top
R27  134.62,29.21 270 top
R28  138.43,29.21 270 top
R29  143.51,29.21 270 top
R30  147.32,29.21 270 top
R31  152.4,29.21 270 top
R32  156.21,29.21 270 top
R33  34.29,6.35 180 top
R34  50.8,66.04 180 top
R35  50.8,71.12 180 top
R36  50.8,76.2 180 top
R37  50.8,81.28 180 top
R38  50.8,43.18 180 top
R39  50.8,48.26 180 top
R40  50.8,53.34 180 top
R41  50.8,58.42 180 top
R42  109.22,63.5 0 top
R43  109.22,58.42 0 top
R44  109.22,53.34 0 top
R45  109.22,48.26 0 top
R46  109.22,86.36 0 top
R47  109.22,81.28 0 top
R48  109.22,76.2 0 top
R49  109.22,71.12 0 top
R61  12.7,86.36 180 top
R62  12.7,81.28 180 top
R63  12.7,76.2 180 top
R64  12.7,71.12 180 top
R65  12.7,63.5 180 top
R66  12.7,58.42 180 top
R67  12.7,53.34 180 top
R68  12.7,48.26 180 top
R69  147.32,43.18 0 top
R70  147.32,48.26 0 top
R71  147.32,53.34 0 top
R72  147.32,58.42 0 top
R73  147.32,66.04 0 top
R74  147.32,71.12 0 top
R75  147.32,76.2 0 top
R76  147.32,81.28 0 top
U1  38.1,74.93 270 top
U2  38.1,52.07 270 top
U3  121.92,54.61 90 top
U4  121.92,77.47 90 top
U5  25.4,77.47 270 top
U6  25.4,54.61 270 top
U7  134.62,52.07 90 top
U8  134.62,74.93 90 top
X1  80.01,7.62 0 top

### Tracks (layer width: path | path; a pad name or v marks a point on that pad's centre or on a via)
+12V
  Top 0.61: R33.1 D1.C 43.18,1.91 | 43.18,1.91 4.45,1.91 1.27,5.08 1.27,94.61 4.45,97.79 24.13,97.79 27.3,94.61 27.3,86.36 | 27.3,86.36 27.3,81.28 | U5.14 27.3,81.28 | 27.3,81.28 27.3,76.2 | U5.12 27.3,76.2 | 27.3,76.2 27.3,71.12 | U5.10 27.3,71.12 | 27.3,71.12 27.3,63.5 | U6.16 27.3,63.5 | 27.3,63.5 27.3,58.42 | U6.14 27.3,58.42 | 27.3,58.42 27.3,53.34 | 27.3,53.34 U6.12 | U6.10 27.94,48.26 27.3,48.9 27.3,53.34 | 132.72,81.28 132.72,94.61 135.89,97.79 155.57,97.79 158.75,94.61 158.75,5.08 155.57,1.91 116.2,1.91 | U8.10 132.72,81.28 | 132.72,81.28 132.72,76.2 | U8.12 132.72,76.2 | 132.72,76.2 132.72,71.12 | U8.14 132.72,71.12 | 132.72,71.12 132.72,66.04 | U8.16 132.72,66.04 | 132.72,66.04 132.72,58.42 | U7.10 132.72,58.42 | 132.72,58.42 132.72,53.34 | U7.12 132.72,53.34 | 132.72,53.34 132.72,48.26 | U7.14 132.72,48.26 | 132.72,48.26 132.72,43.81 132.08,43.18 U7.16 | 27.3,86.36 U5.16 | X1.1 64.77,1.91 | 43.18,1.91 64.77,1.91 | 64.77,1.91 107.95,1.91 | C3.1 107.95,1.91 | 107.95,1.91 116.2,1.91 | C4.+ 116.2,1.91
GND
  Top 0.61: U1.2 35.56,81.28 36.2,80.64 36.2,76.2 | U1.4 36.2,76.2 | 36.2,76.2 36.2,71.12 | U1.6 36.2,71.12 | 36.2,71.12 36.2,66.04 | U1.8 36.2,66.04 | 36.2,66.04 36.2,58.42 | U2.2 36.2,58.42 | 36.2,58.42 36.2,53.34 | U2.4 36.2,53.34 | 36.2,53.34 36.2,48.26 | U2.6 36.2,48.26 | 36.2,48.26 36.2,43.18 | U2.8 36.2,43.18 | 36.2,43.18 36.2,21.59 37.47,20.32 LED5.K | U4.8 124.46,86.36 123.83,85.72 123.83,81.28 | U4.6 123.83,81.28 | 123.83,81.28 123.83,76.2 | U4.4 123.83,76.2 | 123.83,76.2 123.83,71.12 | U4.2 123.83,71.12 | 123.83,71.12 123.83,63.5 | U3.8 123.83,63.5 | 123.83,63.5 123.83,58.42 | U3.6 123.83,58.42 | 123.83,58.42 123.83,53.34 | U3.4 123.83,53.34 | 123.83,53.34 123.83,48.26 | U3.2 123.83,48.26 | 123.83,48.26 123.83,21.59 125.09,20.32 LED13.K
  pour Bottom (isolate 0.61): 0.64,0.64 159.38,0.64 159.38,22.23 0.64,22.23
GPA0
  Top 0.305: R37.2 49.53,81.28 50.8,82.55 PORT1.3
  Bottom 0.305: R61.2 8.89,85.09 37.47,85.09 38.1,84.45 38.1,81.92 38.73,81.28 U1.15 R37.2
GPA1
  Top 0.305: R36.2 50.8,76.2 52.07,77.47 52.07,92.71 PORT1.4
  Bottom 0.305: R62.2 8.89,80.01 37.47,80.01 38.1,79.38 38.1,76.83 38.73,76.2 U1.13 R36.2
GPA2
  Top 0.305: R35.2 52.07,71.12 53.34,72.39 PORT1.5
  Bottom 0.305: R63.2 8.89,74.93 37.47,74.93 38.1,74.3 38.1,71.75 38.73,71.12 U1.11 R35.2
GPA3
  Top 0.305: R34.2 53.34,66.04 54.61,67.31 54.61,92.71 PORT1.6
  Bottom 0.305: R64.2 8.89,69.85 37.47,69.85 38.1,69.22 38.1,66.67 38.73,66.04 U1.9 R34.2
GPA4
  Top 0.305: R41.2 53.34,58.42 55.24,60.33 55.88,60.33 57.15,61.59 57.15,82.55 55.88,83.82 PORT1.7
  Bottom 0.305: R65.2 8.89,62.23 37.47,62.23 38.1,61.59 38.1,59.05 38.73,58.42 U2.15 R41.2
GPA5
  Top 0.305: R40.2 53.34,53.34 55.24,55.24 56.52,55.24 57.78,56.52 57.78,83.19 57.15,83.82 57.15,92.71 PORT1.8
  Bottom 0.305: R66.2 8.89,57.15 37.47,57.15 38.1,56.52 38.1,53.98 38.73,53.34 U2.13 R40.2
GPA6
  Top 0.305: R39.2 53.34,48.26 55.24,50.16 57.15,50.16 58.42,51.44 PORT1.9
  Bottom 0.305: R67.2 8.89,52.07 37.47,52.07 38.1,51.44 38.1,48.9 38.73,48.26 U2.11 R39.2
GPA7
  Top 0.305: R38.2 53.34,43.18 55.24,45.09 57.78,45.09 59.05,46.35 59.05,83.19 59.69,83.82 59.69,92.71 PORT1.10
  Bottom 0.305: R68.2 8.89,46.99 37.47,46.99 38.1,46.35 38.1,43.81 38.73,43.18 U2.9 R38.2
GPB0
  Top 0.305: R45.2 106.68,48.26 104.78,50.16 102.23,50.16 100.97,51.44 100.97,88.9 102.23,90.17 102.87,90.17 PORT2.3
  Bottom 0.305: R69.2 151.13,44.45 123.19,44.45 121.92,45.72 121.92,46.99 120.65,48.26 U3.15 R45.2
GPB1
  Top 0.305: R44.2 106.68,53.34 104.78,55.24 102.87,55.24 101.6,56.52 101.6,88.27 102.87,89.53 104.78,89.53 105.41,90.17 105.41,92.71 PORT2.4
  Bottom 0.305: R70.2 151.13,49.53 123.19,49.53 121.92,50.8 121.92,52.07 120.65,53.34 U3.13 R44.2
GPB2
  Top 0.305: R43.2 106.68,58.42 104.78,60.33 103.5,60.33 102.23,61.59 102.23,87.63 103.5,88.9 106.05,88.9 106.68,89.53 PORT2.5
  Bottom 0.305: R71.2 151.13,54.61 123.19,54.61 121.92,55.88 121.92,57.15 120.65,58.42 U3.11 R43.2
GPB3
  Top 0.305: R42.2 106.68,63.5 104.78,65.41 104.14,65.41 102.87,66.67 102.87,87 103.5,87.63 106.68,87.63 107.95,88.9 107.95,92.71 PORT2.6
  Bottom 0.305: R72.2 151.13,59.69 123.19,59.69 121.92,60.96 121.92,62.23 120.65,63.5 U3.9 R42.2
GPB4
  Top 0.305: R49.2 110.49,71.12 109.22,72.39 PORT2.7
  Bottom 0.305: R73.2 151.13,67.31 123.19,67.31 121.92,68.58 121.92,69.85 120.65,71.12 U4.15 R49.2
GPB5
  Top 0.305: R48.2 111.76,76.2 110.49,77.47 110.49,92.71 PORT2.8
  Bottom 0.305: R74.2 151.13,72.39 123.19,72.39 121.92,73.66 121.92,74.93 120.65,76.2 U4.13 R48.2
GPB6
  Top 0.305: R47.2 113.03,82.55 113.03,90.17 PORT2.9
  Bottom 0.305: R75.2 151.13,77.47 123.19,77.47 121.92,78.74 121.92,80.01 120.65,81.28 U4.11 R47.2
GPB7
  Top 0.305: R46.2 114.3,92.71 113.03,93.98 PORT2.10
  Bottom 0.305: R76.2 151.13,82.55 123.19,82.55 121.92,83.82 121.92,85.09 120.65,86.36 U4.9 R46.2
N$1
  Bottom 0.305: R61.1 U5.1
N$2
  Top 0.61: 40.01,91.44 40.01,83.82 | U1.16 40.01,83.82 | 40.01,83.82 40.01,78.74 | U1.14 40.01,78.74 | 40.01,78.74 40.01,73.66 | U1.12 40.01,73.66 | 40.01,73.66 40.01,68.58 | U1.10 40.01,68.58 | 40.01,60.96 40.01,68.58 | 40.01,60.96 U2.16 53.98,60.96 C1.1 | 40.01,60.96 40.01,55.88 | U2.14 40.01,55.88 | 40.01,55.88 40.01,50.8 | U2.12 40.01,50.8 | 40.01,50.8 40.01,46.62 40.9,45.72 U2.10 | PORT1.1 40.01,91.44 | JP1.1 JP1.3 41.27,95.89 40.01,94.61 40.01,91.44
N$3
  Top 0.305: R2.2 LED1.A
N$4
  Top 0.61: 120.02,83.82 120.02,78.74 | U4.12 120.02,78.74 | 120.02,78.74 120.02,73.66 | U4.14 120.02,73.66 | 120.02,73.66 120.02,68.58 | 120.02,68.58 U4.16 106.05,68.58 C2.1 | 120.02,68.58 120.02,60.96 | U3.10 120.02,60.96 | 120.02,60.96 120.02,55.88 | U3.12 120.02,55.88 | 120.02,55.88 120.02,50.8 | U3.14 120.02,50.8 | 120.02,50.8 120.02,46.62 119.12,45.72 U3.16 | U4.10 120.02,83.82 | 120.02,83.82 120.02,92.71 116.84,95.89 98.42,95.89 | 98.42,95.89 JP6.4 JP6.2 | PORT2.1 99.69,91.44 98.42,92.71 98.42,95.89
N$5
  Top 0.305: R4.2 LED2.A
N$6
  Top 0.305: R6.2 LED3.A
N$7
  Top 0.305: R8.2 LED4.A
N$11
  Bottom 0.305: R62.1 U5.3
N$12
  Bottom 0.305: R63.1 U5.5
N$13
  Bottom 0.305: R64.1 U5.7
N$14
  Bottom 0.305: R65.1 U6.1
N$15
  Bottom 0.305: R66.1 U6.3
N$16
  Top 0.305: R10.2 LED5.A
N$17
  Bottom 0.305: R67.1 U6.5
N$18
  Bottom 0.305: R68.1 U6.7
N$19
  Bottom 0.305: R69.1 U7.1
N$20
  Top 0.305: R12.2 LED6.A
N$22
  Bottom 0.305: R70.1 U7.3
N$23
  Top 0.305: R14.2 LED7.A
N$25
  Bottom 0.305: R71.1 U7.5
N$26
  Top 0.305: R16.2 LED8.A
N$29
  Bottom 0.305: R72.1 U7.7
N$30
  Top 0.305: R18.2 LED9.A
N$31
  Bottom 0.305: U8.1 R73.1
N$32
  Bottom 0.305: U8.3 R74.1
N$33
  Top 0.305: R20.2 LED10.A
N$35
  Bottom 0.305: U8.5 R75.1
N$36
  Top 0.305: R22.2 LED11.A
N$38
  Bottom 0.305: U8.7 R76.1
N$39
  Top 0.305: R24.2 LED12.A
N$41
  Top 0.305: R26.2 LED13.A
N$44
  Top 0.305: R28.2 LED14.A
N$47
  Top 0.305: R30.2 LED15.A
N$50
  Top 0.305: R32.2 LED16.A
N$52
  Top 0.305: LED17.A R33.2
PORT1_VSS  (via drill 0.9)
  Top 0.61: U6.8 22.86,45.72 23.5,46.35 23.5,50.8 | U6.6 23.5,50.8 | 23.5,50.8 23.5,55.88 | 23.5,55.88 U6.4 | 23.5,60.96 23.5,55.88 | U6.2 23.5,60.96 | 23.5,60.96 23.5,68.58 | 23.5,68.58 U5.8 | U5.6 23.5,73.66 | 23.5,73.66 23.5,68.58 | U5.4 23.5,78.74 | 23.5,78.74 23.5,73.66 | U5.2 23.5,83.82 | 23.5,83.82 23.5,78.74 | 23.5,83.82 v23.5,94.61
  Bottom 0.61: v23.5,94.61 31.11,94.61 | R37.1 60.33,81.28 61.59,82.55 61.59,92.08 62.87,93.34 JP1.5 JP1.7
  pour Bottom (isolate 0.61): 29.21,99.69 29.21,88.27 32.38,88.27 32.38,87 47.62,87 47.62,40.64 63.5,40.64 63.5,99.69
PORT2_VSS  (via drill 0.9)
  Top 0.61: 136.53,83.82 136.53,78.74 | U8.6 136.53,78.74 | 136.53,78.74 136.53,73.66 | U8.4 136.53,73.66 | 136.53,73.66 136.53,68.58 | U8.2 136.53,68.58 | 136.53,68.58 136.53,60.96 | U7.8 136.53,60.96 | 136.53,60.96 136.53,55.88 | U7.6 136.53,55.88 | 136.53,55.88 136.53,50.8 | U7.4 136.53,50.8 | 136.53,50.8 136.53,46.62 137.42,45.72 U7.2 | U8.8 136.53,83.82 | 136.53,83.82 v136.53,94.61
  Bottom 0.61: v136.53,94.61 125.09,94.61 | PORT2.2 97.79,93.98 97.16,93.34 JP6.6 JP6.8
  pour Bottom (isolate 0.61): 130.81,99.69 130.81,87 112.39,87 112.39,40.64 96.52,40.64 96.52,99.69
R1
  Bottom 0.305: R1.2 1.27,26.67 1.27,81.92 1.91,82.55 25.4,82.55 26.67,83.82 U5.15 U1.1
R3
  Bottom 0.305: R3.2 10.16,26.67 10.16,36.2 8.26,38.1 3.81,38.1 1.91,40.01 1.91,76.83 2.54,77.47 25.4,77.47 26.67,78.74 U5.13 U1.3
R5
  Bottom 0.305: R5.2 19.68,26.04 19.68,36.2 17.14,38.73 4.45,38.73 2.54,40.64 2.54,71.75 3.17,72.39 26.04,72.39 27.3,73.66 U5.11 U1.5
R7
  Bottom 0.305: R7.2 27.94,26.67 27.94,36.2 24.77,39.37 5.08,39.37 3.17,41.27 3.17,66.67 3.81,67.31 26.04,67.31 27.3,68.58 U5.9 U1.7
R9
  Bottom 0.305: R9.2 36.83,26.67 36.83,34.92 35.56,36.2 29.21,36.2 25.4,40.01 5.71,40.01 3.81,41.91 3.81,59.05 4.45,59.69 27.94,59.69 U6.15 U2.1
R11
  Bottom 0.305: R11.2 45.72,26.67 45.72,34.92 43.81,36.83 29.84,36.83 26.04,40.64 6.35,40.64 4.45,42.55 4.45,53.98 5.08,54.61 27.94,54.61 U6.13 U2.3
R13
  Bottom 0.305: R13.2 54.61,26.67 54.61,34.92 52.07,37.47 30.48,37.47 26.67,41.27 6.99,41.27 5.08,43.18 5.08,48.9 5.71,49.53 27.94,49.53 U6.11 U2.5
R15
  Bottom 0.305: R15.2 63.5,26.67 63.5,34.92 60.33,38.1 31.11,38.1 29.21,40.01 U6.9 U2.7
R17
  Bottom 0.305: R17.2 96.52,30.48 96.52,34.92 99.69,38.1 128.27,38.1 132.08,41.91 153.03,41.91 154.31,43.18 154.31,46.35 153.67,46.99 132.08,46.99 U7.15 U3.1
R19
  Bottom 0.305: R19.2 105.41,30.48 105.41,34.92 107.95,37.47 128.91,37.47 132.72,41.27 153.67,41.27 154.94,42.55 154.94,51.44 154.31,52.07 132.08,52.07 U7.13 U3.3
R21
  Bottom 0.305: R21.2 114.3,30.48 114.3,34.92 116.2,36.83 129.54,36.83 133.35,40.64 154.31,40.64 155.57,41.91 155.57,56.52 154.94,57.15 132.08,57.15 U7.11 U3.5
R23
  Bottom 0.305: R23.2 123.83,31.11 123.83,34.92 124.46,35.56 129.54,35.56 133.99,40.01 154.94,40.01 156.21,41.27 156.21,61.59 155.57,62.23 132.08,62.23 U7.9 U3.7
R25
  Bottom 0.305: R25.2 132.08,30.48 132.08,36.83 134.62,39.37 155.57,39.37 156.84,40.64 156.84,69.22 156.21,69.85 135.89,69.85 134.62,68.58 131.44,68.58 U8.15 U4.1
R27
  Bottom 0.305: R27.2 140.97,30.48 140.97,35.56 144.15,38.73 156.21,38.73 157.48,40.01 157.48,74.3 156.84,74.93 135.89,74.93 134.62,73.66 131.44,73.66 U8.13 U4.3
R29
  Bottom 0.305: R29.2 149.86,30.48 149.86,35.56 152.4,38.1 156.84,38.1 158.12,39.37 158.12,79.38 157.48,80.01 135.89,80.01 134.62,78.74 U8.11 U4.5
R31
  Bottom 0.305: R31.2 158.75,30.48 158.75,84.45 158.12,85.09 135.89,85.09 134.62,83.82 U8.9 U4.7
X1-3
  Top 0.305: R1.1 R2.1 10.16,31.75 10.16,13.97 13.34,10.79 62.87,10.79 63.5,10.16 63.5,8.26 64.14,7.62 66.04,7.62 X1.3
X1-4
  Top 0.305: R3.1 R4.1 17.14,34.29 19.68,31.75 19.68,14.61 22.86,11.43 64.77,11.43 X1.4
X1-5
  Top 0.305: R5.1 R6.1 27.94,31.75 27.94,15.24 31.11,12.06 66.04,12.06 68.58,9.53 68.58,7.62 X1.5
X1-6
  Top 0.305: R7.1 R8.1 34.29,33.02 33.02,31.75 33.02,15.88 36.2,12.7 67.31,12.7 69.85,10.16 X1.6
X1-7
  Top 0.305: R9.1 R10.1 45.72,31.75 45.72,16.51 48.9,13.34 67.94,13.34 71.12,10.16 71.12,7.62 X1.7
X1-8
  Top 0.305: R11.1 R12.1 54.61,31.75 54.61,17.14 57.78,13.97 68.58,13.97 72.39,10.16 X1.8
X1-9
  Top 0.305: R13.1 R14.1 63.5,31.75 63.5,17.78 66.67,14.61 69.22,14.61 73.66,10.16 73.66,7.62 X1.9
X1-10
  Top 0.305: R15.1 R16.1 72.39,31.75 72.39,12.7 74.93,10.16 X1.10
X1-11
  Top 0.305: R18.1 R17.1 87.63,31.75 87.63,18.41 84.45,15.24 81.28,15.24 76.2,10.16 76.2,7.62 X1.11
X1-12
  Top 0.305: R20.1 R19.1 96.52,31.75 96.52,17.78 93.34,14.61 81.92,14.61 77.47,10.16 X1.12
X1-13
  Top 0.305: R22.1 R21.1 105.41,31.75 105.41,17.14 102.23,13.97 82.55,13.97 78.74,10.16 78.74,7.62 X1.13
X1-14
  Top 0.305: R24.1 R23.1 114.3,31.75 114.3,15.88 111.76,13.34 83.19,13.34 80.01,10.16 X1.14
X1-15
  Top 0.305: R26.1 R25.1 128.27,31.75 128.27,15.24 125.73,12.7 83.82,12.7 81.28,10.16 81.28,7.62 X1.15
X1-16
  Top 0.305: R28.1 R27.1 132.08,31.75 132.08,15.24 128.91,12.06 84.45,12.06 82.55,10.16 X1.16
X1-17
  Top 0.305: R30.1 R29.1 140.97,31.75 140.97,14.61 137.79,11.43 85.09,11.43 83.82,10.16 83.82,7.62 X1.17
X1-18
  Top 0.305: R32.1 R31.1 149.86,31.75 149.86,13.34 147.32,10.79 85.72,10.79 85.09,10.16 X1.18

### Text on the board
Top: Design by JSIF | 01-2012 | OPTO_BOARD_3_OCC_gen
tNames: Design by JSIF | 01-2012 | INPUT | OUTPUT | OUTPUT | INPUT | INPUT | OUTPUT | OUTPUT | INPUT | OPTO_BOARD_3_OCC_gen | 12V